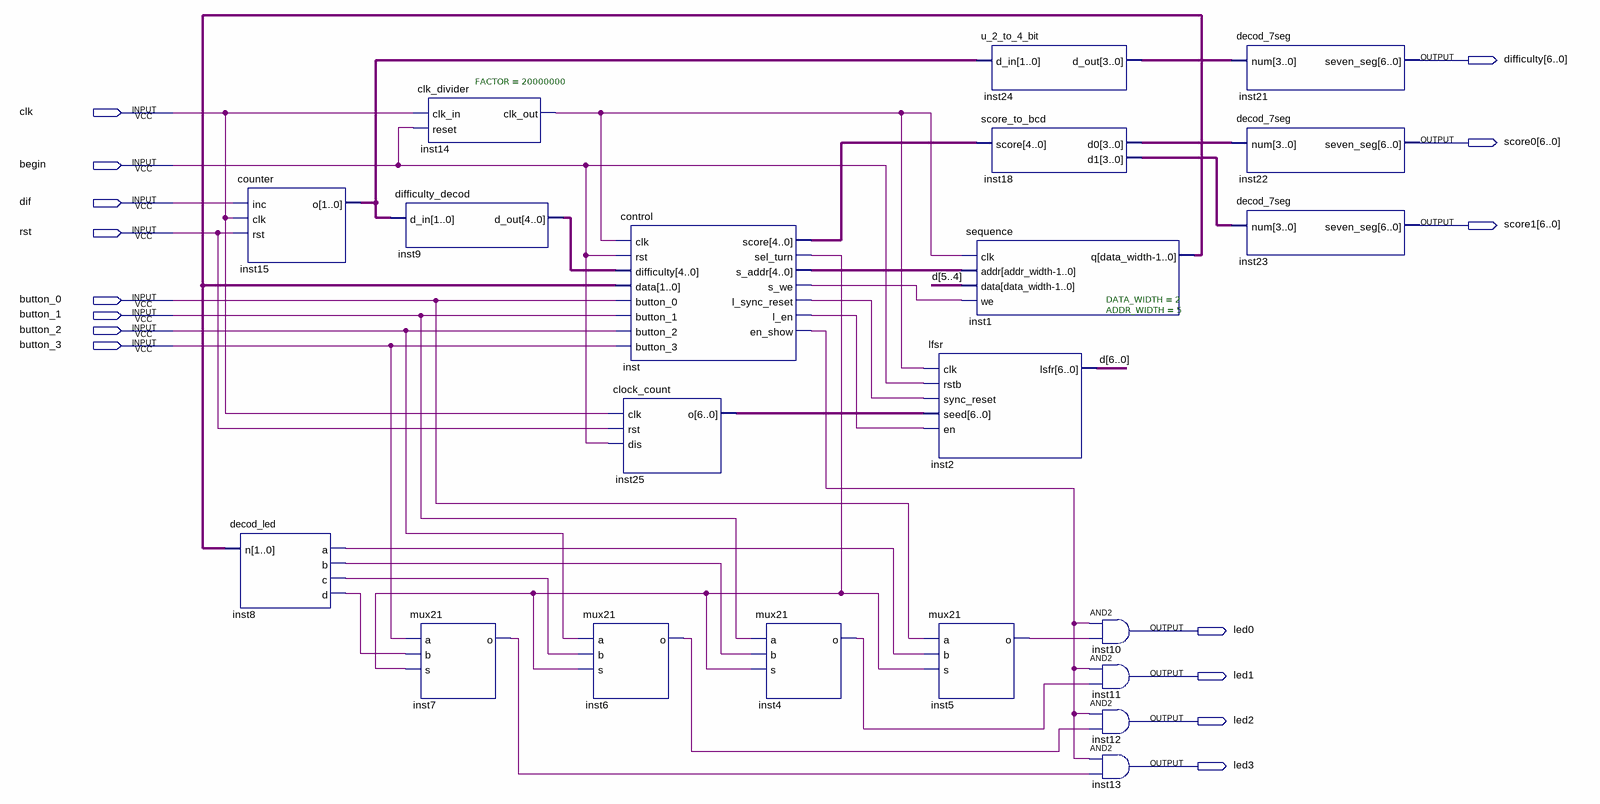
[diagram p0: schematic sheet]
// Quartus schematic genius.bdf as structural Verilog: 21 symbols, 15 pins
module genius (
  input  clk,
  input  \begin ,
  input  dif,
  input  rst,
  input  button_0,
  input  button_1,
  input  button_2,
  input  button_3,
  output [6:0] difficulty,
  output [6:0] score0,
  output [6:0] score1,
  output led0,
  output led1,
  output led2,
  output led3
);

  wire inst4_o, inst5_o, inst6_o, inst7_o, inst8_a, inst8_b, inst8_c, inst8_d, inst14_clk_out, inst_en_show,
       inst_l_en, inst_l_sync_reset, inst_s_we, inst_sel_turn;
  wire [1:0] inst1_q, inst15_o;
  wire [3:0] inst18_d0, inst18_d1, inst24_d_out;
  wire [4:0] inst9_d_out, inst_s_addr, inst_score;
  wire [6:0] d, inst25_o;

  decod_led inst8 (.n(inst1_q), .a(inst8_a), .b(inst8_b), .c(inst8_c), .d(inst8_d));
  counter inst15 (.inc(dif), .clk(clk), .rst(rst), .o(inst15_o));
  difficulty_decod inst9 (.d_in(inst15_o), .d_out(inst9_d_out));
  mux21 inst7 (.a(button_3), .b(inst8_d), .s(inst_sel_turn), .o(inst7_o));
  clk_divider #(.FACTOR(20000000)) inst14 (.clk_in(clk), .reset(\begin ), .clk_out(inst14_clk_out));
  mux21 inst6 (.a(button_2), .b(inst8_c), .s(inst_sel_turn), .o(inst6_o));
  control inst (
    .clk(inst14_clk_out), .rst(\begin ), .difficulty(inst9_d_out), .data(inst1_q), .button_0(button_0),
    .button_1(button_1), .button_2(button_2), .button_3(button_3), .score(inst_score),
    .sel_turn(inst_sel_turn), .s_addr(inst_s_addr), .s_we(inst_s_we), .l_sync_reset(inst_l_sync_reset),
    .l_en(inst_l_en), .en_show(inst_en_show));
  clock_count inst25 (.clk(clk), .rst(rst), .dis(\begin ), .o(inst25_o));
  mux21 inst4 (.a(button_1), .b(inst8_b), .s(inst_sel_turn), .o(inst4_o));
  lfsr inst2 (
    .clk(inst14_clk_out), .rstb(\begin ), .sync_reset(inst_l_sync_reset), .seed(inst25_o), .en(inst_l_en),
    .lsfr(d));
  mux21 inst5 (.a(button_0), .b(inst8_a), .s(inst_sel_turn), .o(inst5_o));
  u_2_to_4_bit inst24 (.d_in(inst15_o), .d_out(inst24_d_out));
  score_to_bcd inst18 (.score(inst_score), .d0(inst18_d0), .d1(inst18_d1));
  \sequence  #(.DATA_WIDTH(2), .ADDR_WIDTH(5)) inst1 (
    .clk(inst14_clk_out), .addr(inst_s_addr), .data(d[5:4]), .we(inst_s_we), .q(inst1_q));
  and inst10 (led0, inst_en_show, inst5_o);
  and inst11 (led1, inst_en_show, inst4_o);
  and inst12 (led2, inst_en_show, inst6_o);
  and inst13 (led3, inst_en_show, inst7_o);
  decod_7seg inst21 (.num(inst24_d_out), .seven_seg(difficulty));
  decod_7seg inst22 (.num(inst18_d0), .seven_seg(score0));
  decod_7seg inst23 (.num(inst18_d1), .seven_seg(score1));
endmodule
